# Altium schematic sheet power-vddr.SchDoc
size Letter; CheckedBy: E. Chiu; CompanyName: Signal Laboratories, Inc.; DrawnBy: J. Brinton; Engineer: J. Brinton; Address1: 3479 Edison Way; Address2: Menlo Park CA 94025; Address3: +1 (877) 778-8435; Address4: siglabs.com; Revision: 1; SheetNumber: 7; SheetTotal: 39
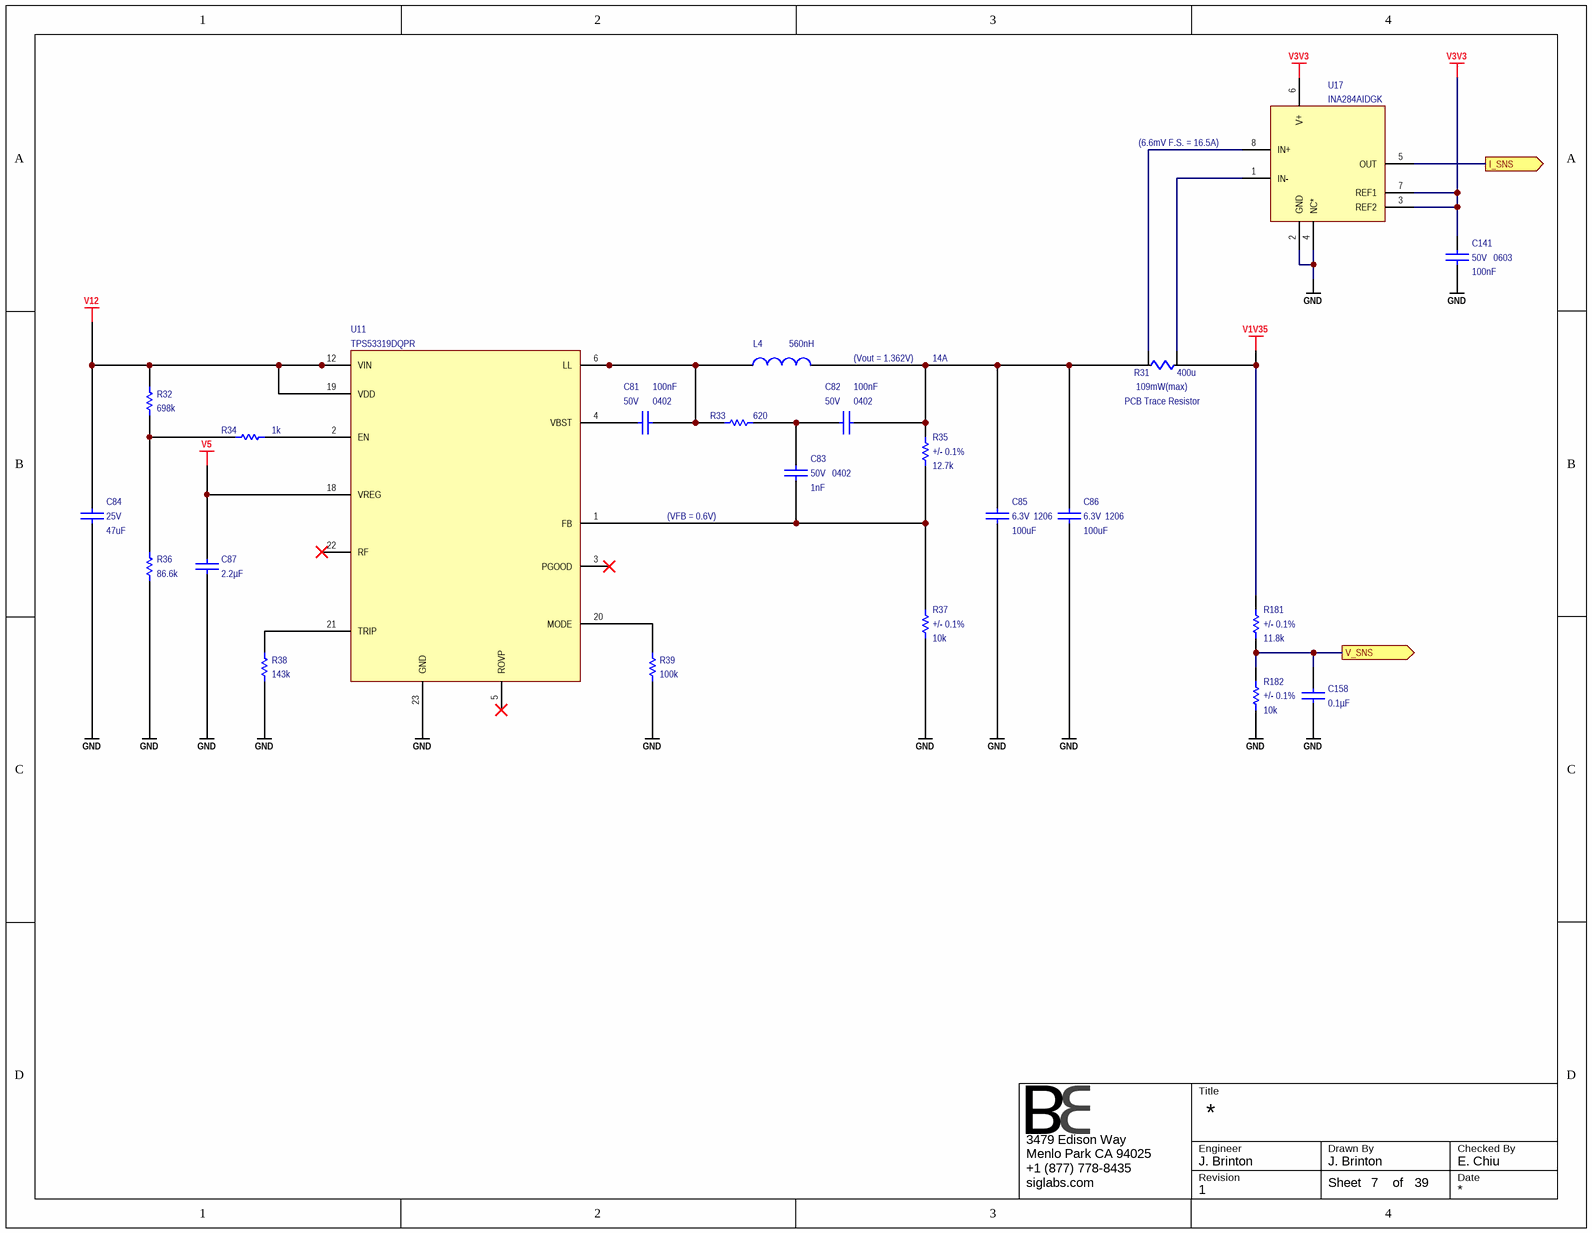
[diagram p0: power-vddr.SchDoc]

## Parts
C81  value 100nF  Voltage: 50V  PCB Package: 0402  [CAPC1005X55N]  (hidden comment: GRM155R71H104ME14D)
C82  value 100nF  Voltage: 50V  PCB Package: 0402  [CAPC1005X55N]  (hidden comment: GRM155R71H104ME14D)
C83  value 1nF  Voltage: 50V  PCB Package: 0402  [CAPC1005X55N]  (hidden comment: GRM155R71H102KA01J)
C84  value 47uF  Voltage: 25V  [CKG57N]  (hidden comment: CKG57NX5R1E476M500JH)
C85  value 100uF  Voltage: 6.3V  PCB Package: 1206  [CAPC3216X180L55N]  (hidden comment: GRM31CR60J107ME39K)
C86  value 100uF  Voltage: 6.3V  PCB Package: 1206  [CAPC3216X180L55N]  (hidden comment: GRM31CR60J107ME39K)
C87  value 2.2µF  [CAPC1608X90N]  (hidden comment: GRM188R71A225KE15D)
C141  value 100nF  Voltage: 50V  PCB Package: 0603  [CAPC1608X90N]  (hidden comment: C0603C104K5RACTU)
C158  value 0.1µF  [CAPC1005X56N]  (hidden comment: GRM155R71A104KA01J)
L4  value 560nH  [XAL6030]  (hidden comment: XAL6030-561MEB)
R31  value 400u  [RES0.0004]  (hidden comment: RES0.0004)
R32  value 698k  [RESC1005X40N]  (hidden comment: ERJ-2RKF6983X)
R33  value 620  [RESC1005X40N]  (hidden comment: ERJ-2GEJ621X)
R34  value 1k  [RESC1005X40N]  (hidden comment: ERJ-2RKF1001X)
R35  value 12.7k  Tolerance: +/- 0.1%  [RESC2012X70N]  (hidden comment: RG2012P-1272-B-T5)
R36  value 86.6k  [RESC1005X40N]  (hidden comment: ERJ-2RKF8662X)
R37  value 10k  Tolerance: +/- 0.1%  [RESC2012X70N]  (hidden comment: RG2012P-103-B-T5)
R38  value 143k  [RESC1005X40N]  (hidden comment: ERJ-2RKF1433X)
R39  value 100k  [RESC1005X40N]  (hidden comment: ERJ-2GEJ104X)
R181  value 11.8k  Tolerance: +/- 0.1%  [RESC2012X70N]  (hidden comment: RG2012P-1182-B-T5)
R182  value 10k  Tolerance: +/- 0.1%  [RESC2012X70N]  (hidden comment: RG2012P-103-B-T5)
U11  TPS53319DQPR  [DQP]
U17  INA284AIDGK  [S-PDSO-G8]

## Ports
I_SNS (out), V_SNS (out)

## Nets
GND: C84.1 C85.2 C86.2 C87.1 C141.1 C158.1 R36.2 R37.1 R38.2 R39.2 R182.1 U11.23(GND) U17.2(GND) U17.4(NC*)
V1V35: R31.2 R181.2
V3V3: C141.2 U17.3(REF2) U17.6(V+) U17.7(REF1)
V5: C87.2 U11.18(VREG)
V12: C84.2 R32.1 U11.12(VIN) U11.13(VIN) U11.14(VIN) U11.15(VIN) U11.16(VIN) U11.17(VIN) U11.19(VDD)
I_SNS: U17.5(OUT) ; port I_SNS
V_SNS: C158.2 R181.1 R182.2 ; port V_SNS
NetC81_1: C81.1 L4.1 R33.2 U11.6(LL) U11.7(LL) U11.8(LL) U11.9(LL) U11.10(LL) U11.11(LL)
NetC81_2: C81.2 U11.4(VBST)
NetC82_1: C82.1 C85.1 C86.1 L4.2 R31.1 R35.2
NetC82_2: C82.2 C83.1 R33.1
NetC83_2: C83.2 R35.1 R37.2 U11.1(FB)
NetR31_3: R31.3 U17.8(IN+)
NetR31_4: R31.4 U17.1(IN-)
NetR32_2: R32.2 R34.1 R36.1
NetR34_2: R34.2 U11.2(EN)
NetR38_1: R38.1 U11.21(TRIP)
NetR39_1: R39.1 U11.20(MODE)

Not connected (* = marked no-connect by the designer): U11 3(PGOOD)* 5(ROVP)* 22(RF)*

## Notes on the sheet
- (near U17) (6.6mV F.S. = 16.5A)
- (Vout = 1.362V)
- 14A
- (near R31) 109mW(max)
- (near R31) PCB Trace Resistor
- (VFB = 0.6V)
- Title
- Engineer
- Revision
- Drawn By
- Checked By
- Date
- Sheet
- of

## Library data of the parts
C81 C82 = CAP 0402: Ceramic Capacitor 100nF +/-20% 50V X7R 0402; Manufacturer: Murata Electronics; Manufacturer P/N: GRM155R71H104ME14D
C83 = CAP: Ceramic Capacitor 1nF +/-10% 50V X7R 0402; Manufacturer: Murata Electronics; Manufacturer P/N: GRM155R71H102KA01J; Tolerance: *; Tr: *
C84 = CAP: Stacked MLCC Capacitor 47uF +/-20% 25V SMD; Manufacturer: TDK Corporation; Tr: -55:125; Manufacturer P/N: CKG57NX5R1E476M500JH; Tolerance: +/-20%
C85 C86 = CAP: Ceramic Capacitor 100uF +/-20% 6.3V X5R 1206; Manufacturer: Murata Electronics; Manufacturer P/N: GRM31CR60J107ME39K; Tolerance: *; Tr: *
C87 = GRM188R71A225KE15D: CAP CER 2.2UF 10V 10% X7R 0603; Manufacturer: Murata Electronics; Manufacturer P/N: GRM188R71A225KE15D; Tolerance: ±10%; Package / Case: 0603 (1608 Metric); Temperature Coefficient: X7R; Voltage - Rated: 10V
C141 = CAP: Ceramic Capacitor 100nF +/-10% 50V X7R 0603; Manufacturer: Kemet; Manufacturer P/N: C0603C104K5RACTU; Tolerance: *; Tr: *
C158 = GRM155R71A104KA01J: CAP CER 0.1UF 10V 10% X7R 0402; Manufacturer: Murata Electronics; Manufacturer P/N: GRM155R71A104KA01J; Temperature Coefficient: X7R; Package / Case: 0402 (1005 Metric); Tolerance: ±10%; Voltage - Rated: 10V
L4 = INDUCTOR: Shielded Power Inductor 560nH, 17A; Manufacturer: Coilcraft; Manufacturer P/N: XAL6030-561MEB
R31 = RES0.0004: Current Sense Resistor 400uOhm TRACE; Manufacturer: *; Manufacturer P/N: *
R32 = RES 0402: Thick Film Resistor 698k +/-1% 0402; Manufacturer: Panasonic; PCB Package: 0402; Manufacturer P/N: ERJ-2RKF6983X
R33 = RES 0402: Thick Film Resistor 620 +/-5% 0402; Manufacturer: Panasonic; PCB Package: 0402; Manufacturer P/N: ERJ-2GEJ621X
R34 = RES 0402: Thick Film Resistor 1k +/-1% 0402; Manufacturer: Panasonic; PCB Package: 0402; Manufacturer P/N: ERJ-2RKF1001X
R35 = RES: Thin Film Resistor 12.7k +/-0.1% SMD 0805; Manufacturer: Susumu; Tr: -55:155; Tcr: *; Manufacturer P/N: RG2012P-1272-B-T5; Voltage: *; Power: *
R36 = RES 0402: Thick Film Resistor 86.6k +/-1% 0402; Manufacturer: Panasonic; PCB Package: 0402; Manufacturer P/N: ERJ-2RKF8662X
R37 R182 = RES: Thin Film Resistor 10k +/-0.1% SMD 0805; Manufacturer: Susumu; Tr: -55:155; Tcr: *; Manufacturer P/N: RG2012P-103-B-T5; Voltage: *; Power: *
R38 = RES 0402: Thick Film Resistor 143k +/-1% 0402; Manufacturer: Panasonic; PCB Package: 0402; Manufacturer P/N: ERJ-2RKF1433X
R39 = RES 0402: Thick Film Resistor 100k +/-5% 0402; Manufacturer: Panasonic; PCB Package: 0402; Manufacturer P/N: ERJ-2GEJ104X
R181 = RES: Thin Film Resistor 11.8k +/-0.1% SMD 0805; Manufacturer: Susumu; Tr: -55:155; Tcr: *; Manufacturer P/N: RG2012P-1182-B-T5; Voltage: *; Power: *
U11 = TPS53319DQPR: Manufacturer: Texas Instruments; Manufacturer P/N: TPS53319DQPR
U17 = INA283AIDGK: Bidirectional Current Shunt Monitor; Manufacturer: Texas Instruments; Manufacturer P/N: INA284AIDGK